# EAGLE schematic Jukebox (EAGLE 7.6.0)
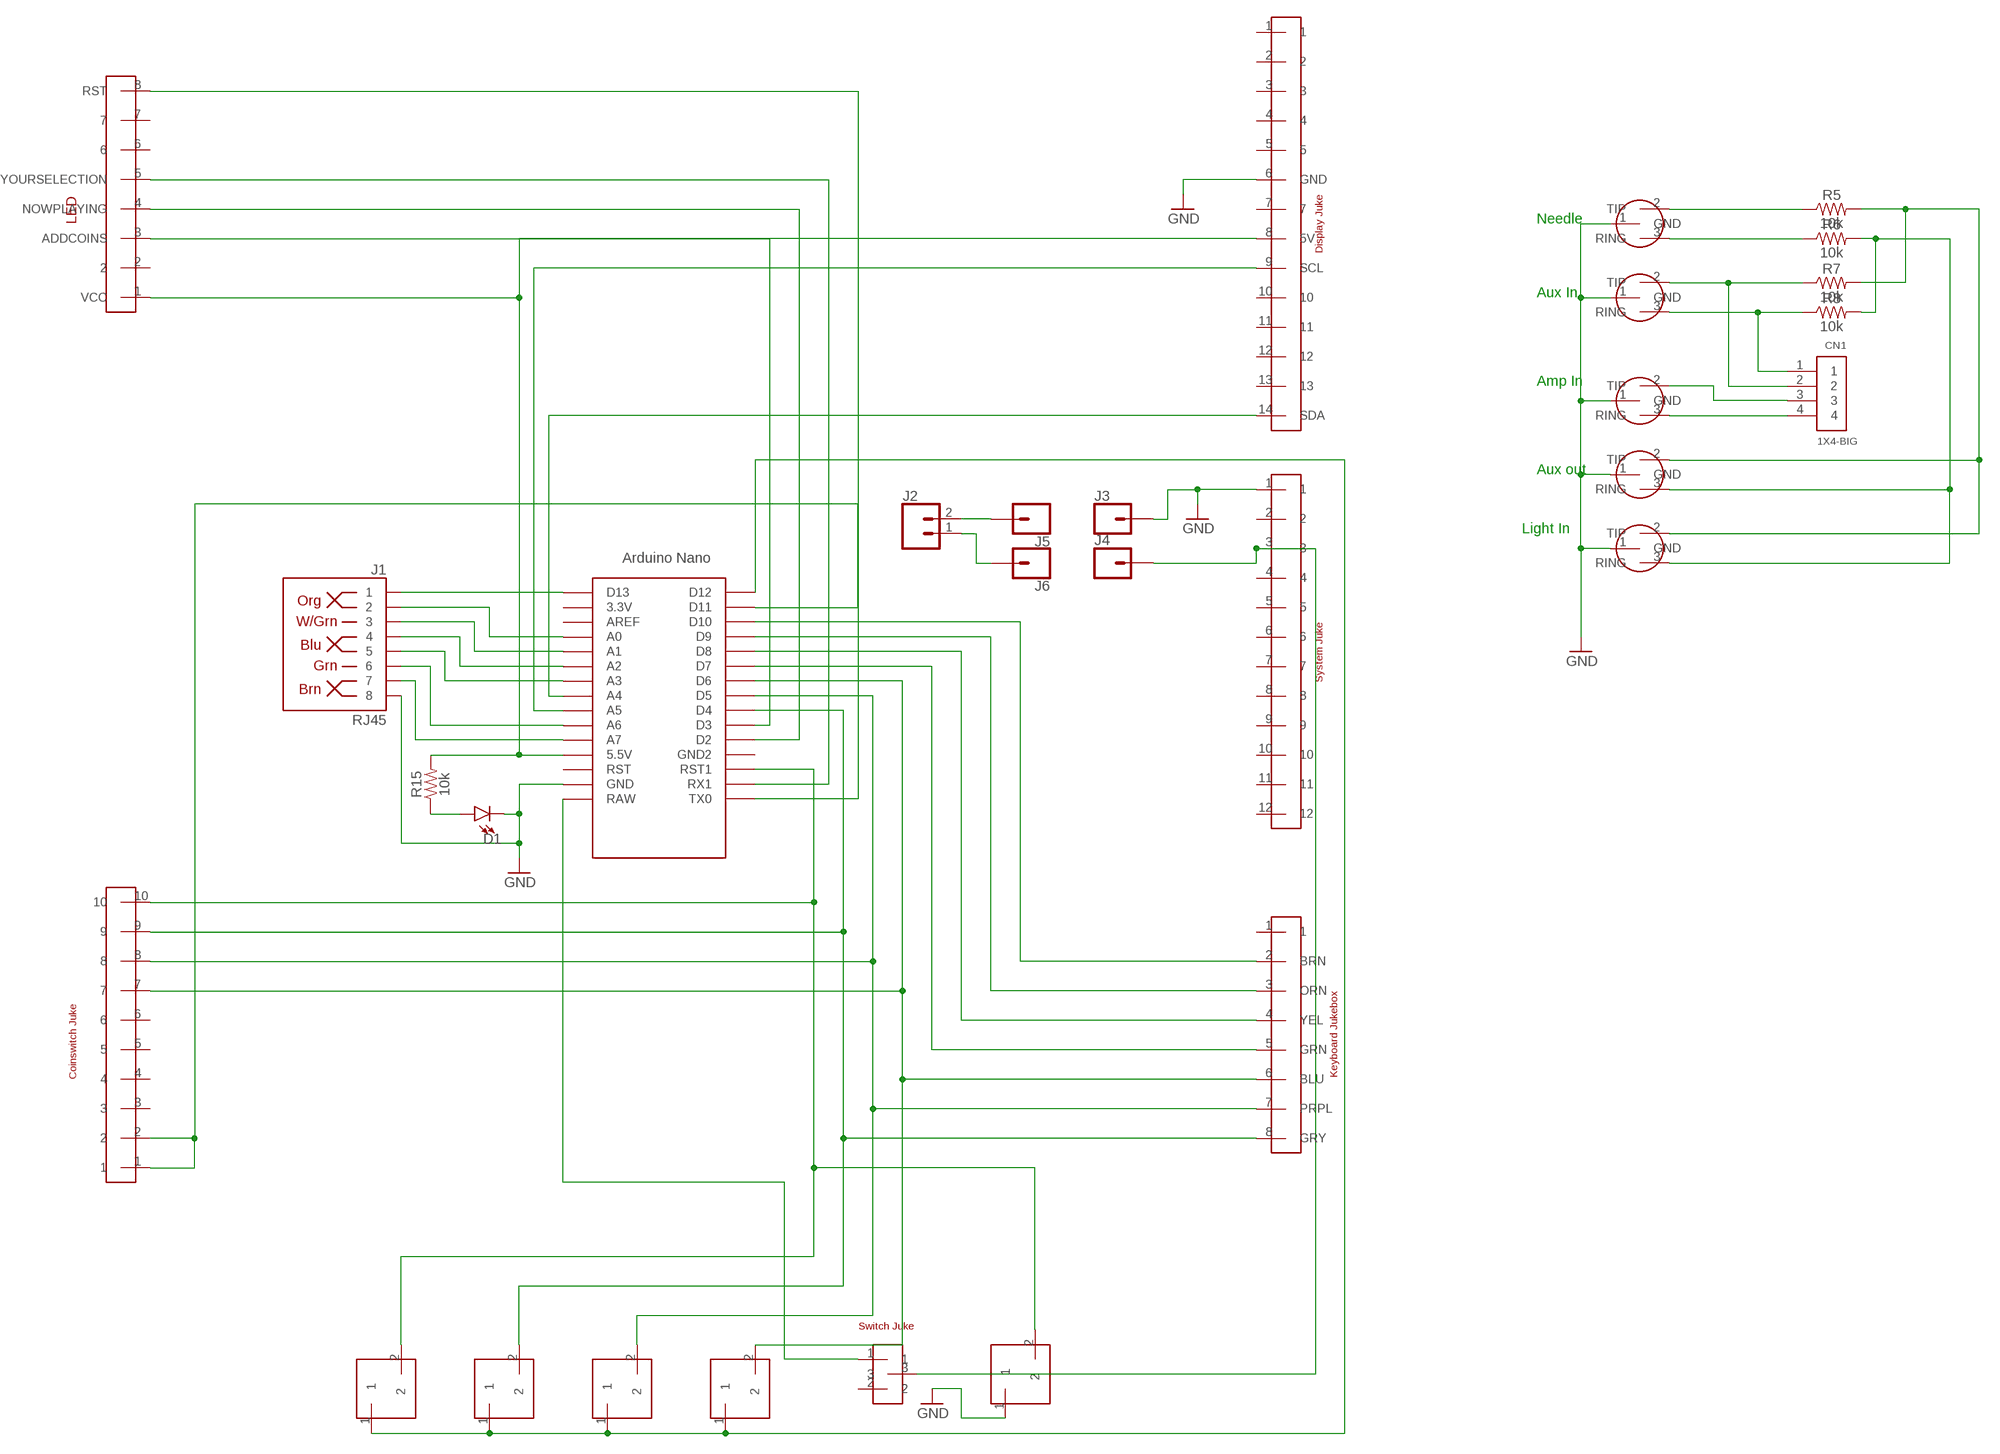
[diagram p0: schematic, sheet 1]

## Parts
CN1  1X4-BIG  [1X04-BIG]
D1  LED5MM  [LED_5MM]
J1  RJ45  RJ45-8  [RJ45-8]
J2  CONN_02  [1X02]
J3  CONN_01  [1X01]
J4  CONN_01  [1X01]
J5  CONN_01  [1X01]
J6  CONN_01  [1X01]
R5  10k  10KOHM-HORIZ-1/4W-1%  [AXIAL-0.3]
R6  10k  10KOHM-HORIZ-1/4W-1%  [AXIAL-0.3]
R7  10k  10KOHM-HORIZ-1/4W-1%  [AXIAL-0.3]
R8  10k  10KOHM-HORIZ-1/4W-1%  [AXIAL-0.3]
R15  10k  10KOHM-HORIZ-1/4W-1%  [AXIAL-0.3]
U$1  NANO  [NANO]
U$2  JUKEHEADPHONE  [JUKEHEADPHONE]
U$3  JUKEHEADPHONE  [JUKEHEADPHONE]
U$4  JUKEHEADPHONE  [JUKEHEADPHONE]
U$5  10PINJUKE  [10PINJUKE]
U$6  8PINJUKE  [8PINJUKE]
U$7  14PINJUKE  [14PINJUKE]
U$8  12PINJUKE  [12PINJUKE]
U$9  JUKEBUTTON  [JUKEBUTTON]
U$10  JUKEBUTTON  [JUKEBUTTON]
U$11  JUKEBUTTON  [JUKEBUTTON]
U$12  JUKEBUTTON  [JUKEBUTTON]
U$13  JUKEBUTTON  [JUKEBUTTON]
U$14  JUKESWITCH  [JUKESWITCH]
U$15  JUKEHEADPHONE  [JUKEHEADPHONE]
U$16  JUKEHEADPHONE  [JUKEHEADPHONE]
U$17  8PINJUKE2  [8PINJUKE]

## Nets
GND: D1.K(C) J1.8 J3.1 U$1.GND U$2.1(GND) U$3.1(GND) U$4.1(GND) U$7.6(GND) U$8.1 U$13.1 U$15.1(GND) U$16.1(GND)
N$1: U$1.D4 U$5.9 U$6.8(GRY) U$10.2
N$2: U$1.D5 U$5.8 U$6.7(PRPL) U$11.2
N$3: U$1.D6 U$5.7 U$6.6(BLU) U$12.2
N$4: U$1.D7 U$6.5(GRN)
N$5: U$1.D8 U$6.4(YEL)
N$6: U$1.D9 U$6.3(ORN)
N$7: U$1.D10 U$6.2(BRN)
N$8: J4.1 U$8.3 U$14.3
N$9: U$1.RST1 U$5.10 U$9.2 U$13.2
N$10: U$1.D12 U$9.1 U$10.1 U$11.1 U$12.1
N$11: U$1.D11 U$5.1 U$5.2
N$12: U$1.A4 U$7.14(SDA)
N$13: CN1.3 U$15.2(TIP)
N$14: CN1.4 U$15.3(RING)
N$15: J2.2 J5.1
N$16: R6.P$1 U$3.3(RING)
N$17: R5.P$1 U$3.2(TIP)
N$18: CN1.2 R7.P$1 U$4.2(TIP)
N$19: CN1.1 R8.P$1 U$4.3(RING)
N$20: J2.1 J6.1
N$21: U$1.A5 U$7.9(SCL)
N$22: U$1.D3 U$17.3(ADDCOINS)
N$23: R6.P$2 R8.P$2 U$2.3(RING) U$16.3(RING)
N$24: R5.P$2 R7.P$2 U$2.2(TIP) U$16.2(TIP)
N$25: U$1.D2 U$17.4(NOWPLAYING)
N$26: J1.1 U$1.D13
N$27: R15.P$2 U$1.5V(5.5V) U$7.8(5V) U$17.1(VCC)
N$28: J1.2 U$1.A0
N$29: J1.3 U$1.A1
N$30: J1.4 U$1.A2
N$31: J1.5 U$1.A3
N$32: U$1.RAW U$14.1
N$33: D1.A R15.P$1
N$34: U$1.RX1 U$17.5(YOURSELECTION)
N$35: J1.6 U$1.A6
N$36: J1.7 U$1.A7
N$37: U$1.TX0 U$17.8(RST)
Unconnected: U$1.3.3V U$1.AREF U$1.GND1(GND2) U$1.ICSP1 U$1.ICSP2 U$1.ICSP3 U$1.ICSP4 U$1.ICSP5 U$1.ICSP6 U$1.RST U$5.3 U$5.4 U$5.5 U$5.6 U$6.1 U$7.1 U$7.2 U$7.3 U$7.4 U$7.5 U$7.7 U$7.10 U$7.11 U$7.12 U$7.13 U$8.2 U$8.4 U$8.5 U$8.6 U$8.7 U$8.8 U$8.9 U$8.10 U$8.11 U$8.12 U$14.2 U$17.2 U$17.6 U$17.7

## Notes on the sheet
- Needle
- Aux In
- Amp In
- Aux out
- Light In

## Library data of the parts
CN1 = adafruit:1X4: 4-pin connector
D1 = SparkFun-LED:LED: LED (Generic) Standard schematic elements and footprints for 5mm, 3mm, 1206, and 0603 sized LEDs. Generic LEDs with no color specified.
J1 = SparkFun-Connectors:RJ45-8: RJ45 Jack - 8 pin Simple RJ45, 8-pin connection. Commonly used for Cat5, Cat5e, and Cat6 Ethernet cables. Here is the connector we sell at SparkFun: RJ45 8-Pin Connector <https://www.sparkfun.com/products/643> (PRT-00643) Datasheet <https://cdn.sparkfun.com/datasheets/Prototyping/04908.pdf> It is used on this SparkFun product: SparkFun RJ45 Breakout <https://www.sparkfun.com/products/716> (BOB-00716) Note, you may also be interested in the "MAGJACK" version of this. It is basically a RJ45 connector, but also has some status LEDs built into the connector housing. You can check that out in this library at the device named "MAGJACK.dev" and see these products online: RJ45 Ethernet MagJack-Compatible <https://www.sparkfun.com/products/8534> (PRT-08534) SparkFun RJ45 MagJack Breakout <https://www.sparkfun.com/products/13021> (BOB-13021); PROD_ID: CONN-08506; SF_ID: PRT-00643
J2 = SparkFun-Connectors:CONN_02: Multi connection point. Often used as Generic Header-pin footprint for 0.1 inch spaced/style header connections On any of the 0.1 inch spaced packages, you can populate with these: Break Away Headers - Straight <https://www.sparkfun.com/products/116> (PRT-00116) Break Away Male Headers - Right Angle <https://www.sparkfun.com/products/553> (PRT-00553) Female Headers <https://www.sparkfun.com/products/115> (PRT-00115) Break Away Headers - Machine Pin <https://www.sparkfun.com/products/117> (PRT-00117) Break Away Female Headers - Swiss Machine Pin <https://www.sparkfun.com/products/743> (PRT-00743) For SCREWTERMINALS and SPRING TERMINALS visit here: Screw Terimnals on SparkFun.com <https://www.sparkfun.com/search/results?term=Screw+Terminals> (5mm/3.5mm/2.54mm spacing) This device is also useful as a general connection point to wire up your design to another part of your project. Our various solder wires solder well into these plated through hole pads. Hook-Up Wire - Assortment (Stranded, 22 AWG) <https://www.sparkfun.com/products/11375> (PRT-11375) Hook-Up Wire - Assortment (Solid Core, 22 AWG) <https://www.sparkfun.com/products/11367> (PRT-11367) View the entire wire category on our website here <https://www.sparkfun.com/categories/141> Special notes: Molex polarized connector foot print use with: PRT-08233 with associated crimp pins and housings. 2.54_SCREWTERM for use with PRT-10571. 3.5mm Screw Terminal footprints for PRT-08084 5mm Screw Terminal footprints for use with PRT-08432
J3-J6 = SparkFun-Connectors:CONN_01: Single connection point. Often used as Generic Header-pin footprint for 0.1 inch spaced/style header connections On any of the 0.1 inch spaced packages, you can populate with these: Break Away Headers - Straight <https://www.sparkfun.com/products/116> (PRT-00116) Break Away Male Headers - Right Angle <https://www.sparkfun.com/products/553> (PRT-00553) Female Headers <https://www.sparkfun.com/products/115> (PRT-00115) Break Away Headers - Machine Pin <https://www.sparkfun.com/products/117> (PRT-00117) Break Away Female Headers - Swiss Machine Pin <https://www.sparkfun.com/products/743> (PRT-00743) This device is also useful as a general connection point to wire up your design to another part of your project. Our various solder wires solder well into these plated through hole pads. Hook-Up Wire - Assortment (Stranded, 22 AWG) <https://www.sparkfun.com/products/11375> (PRT-11375) Hook-Up Wire - Assortment (Solid Core, 22 AWG) <https://www.sparkfun.com/products/11367> (PRT-11367) View the entire wire category on our website here <https://www.sparkfun.com/categories/141> Special notes: SMTSO-256-ET is a "flush mount" nut for a 4-40 screw. We mostly use this on specialty testbeds; it is a nice way to connect hardware to your PCB at an adjustable hieght. Also note, the SNAP packages are for using a snappable style connector. We sell a baggie of snaps and they are also used on two LilyPad designs: Snap Assortment - 30 pack (male and female) <https://www.sparkfun.com/products/11347> (DEV-11347) LilyPad Arduino SimpleSnap <https://www.sparkfun.com/products/10941> (DEV-10941) LilyPad SimpleSnap Protoboard <https://www.sparkfun.com/products/10940> (DEV-10940)
R5-R8 R15 = SparkFun-Resistors:10KOHM: 10kΩ resistor A resistor is a passive two-terminal electrical component that implements electrical resistance as a circuit element. Resistors act to reduce current flow, and, at the same time, act to lower voltage levels within circuits. - Wikipedia; PROD_ID: RES-12183
U$1 = Arduino-clone:NANO: Arduino Nano
U$2-U$4 U$15 U$16 = Jukebox:JUKEHEADPHONE
U$5 = Jukebox:10PINJUKE
U$6 = Jukebox:8PINJUKE
U$7 = Jukebox:14PINJUKE
U$8 = Jukebox:12PINJUKE
U$9-U$13 = Jukebox:JUKEBUTTON
U$14 = Jukebox:JUKESWITCH
U$17 = Jukebox:8PINJUKE2